# EAGLE design Bias_Lighting_Controller_Schematic (EAGLE 7.5.0)
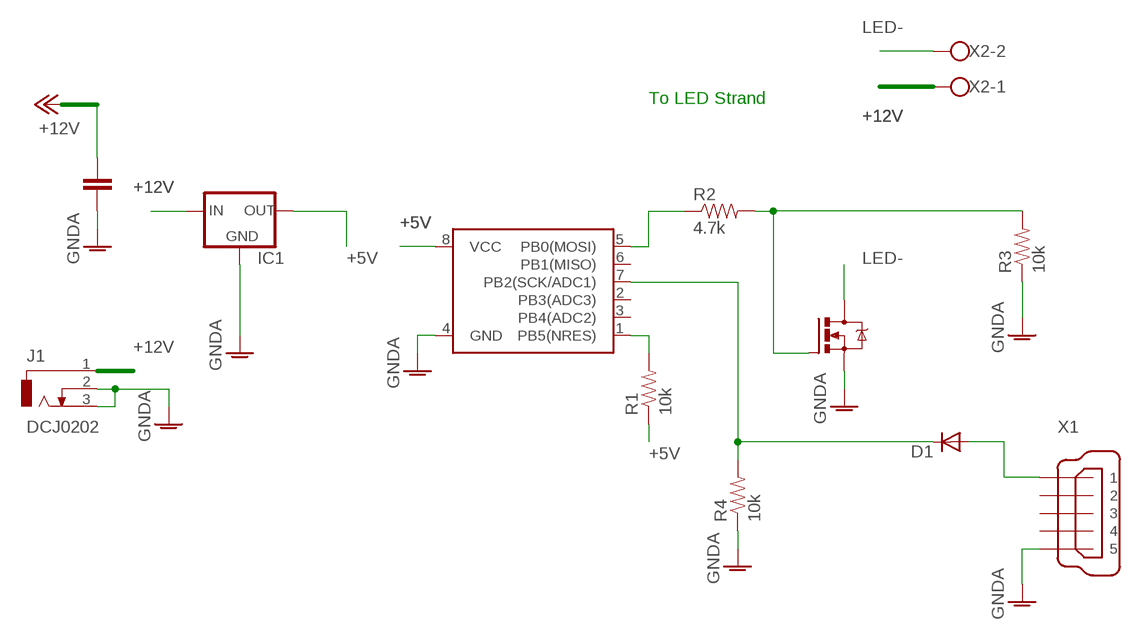
[diagram p0: schematic, sheet 1]

## Parts
C1  CAP1206  [1206]
D1  DIODESMA  [SMA-DIODE]
IC1  78LXX  [78LXX]
IRF740_MOSFET  IRF740  [TO220BV]
J1  DCJ0202  [DCJ0202]
R1  10k  RESISTOR1206  [1206]
R2  4.7k  RESISTOR1206  [1206]
R3  10k  RESISTOR1206  [1206]
R4  10k  RESISTOR1206  [1206]
U$1  ATTINY45DIP8  [DIP08]
X1  MINI-USB-UX60-MB-5ST  [UX60-MB-5ST]
X2  W237-102  [W237-102]

## Nets
+5V: IC1.OUT R1.1 U$1.8(VCC)
+12V: C1.2 IC1.IN J1.1 X2.1
GNDA: C1.1 IC1.GND IRF740_MOSFET.S J1.2 J1.3 R3.1 R4.1 U$1.4(GND) X1.5
LED-: IRF740_MOSFET.D X2.2
N$1: R1.2 U$1.1(PB5(NRES))
N$2: R2.1 U$1.5(PB0(MOSI))
N$3: D1.A X1.1
N$4: IRF740_MOSFET.G R2.2 R3.2
N$5: D1.C R4.2 U$1.7(PB2(SCK/ADC1))
Unconnected: U$1.2(PB3(ADC3)) U$1.3(PB4(ADC2)) U$1.6(PB1(MISO)) X1.2 X1.3 X1.4

## Notes on the sheet
- To LED Strand

## Library data of the parts
C1 = SparkFun-Passives:CAP: Capacitor Standard 0603 ceramic capacitor, and 0.1" leaded capacitor.
D1 = SparkFun-DiscreteSemi:DIODE: Diode These are standard reverse protection diodes and small signal diodes. SMA package can handle up to about 1A. SOD-323 can handle about 200mA. What the SOD-323 package when ordering, there are some mfgs out there that are 5-pin packages.
IC1 = v-reg:78LXX: VOLTAGE REGULATOR
IRF740_MOSFET = transistor-power:IRF740: N-CHANNEL MOS FET
J1 = con-jack:DCJ0202: DC POWER JACK Source: DCJ0202.pdf; OC_FARNELL: unknown; OC_NEWARK: unknown
R1-R4 = SparkFun-Resistors:RESISTOR: Resistor Basic schematic elements and footprints for 0603, 1206, and PTH resistors.
U$1 = SparkFun-DigitalIC:ATTINY45: Atmel 8-pin 2/4/8kB flash uC
X1 = con-hirose:MINI-USB-: MINI USB Connector Source: http://www.hirose.co.jp/cataloge_hp/e24000019.pdf; OC_FARNELL: unknown; OC_NEWARK: unknown
X2 = con-wago-500:W237-102: WAGO SCREW CLAMP; MPN: 237-102; OC_FARNELL: unknown; OC_NEWARK: 70K9898

## Board
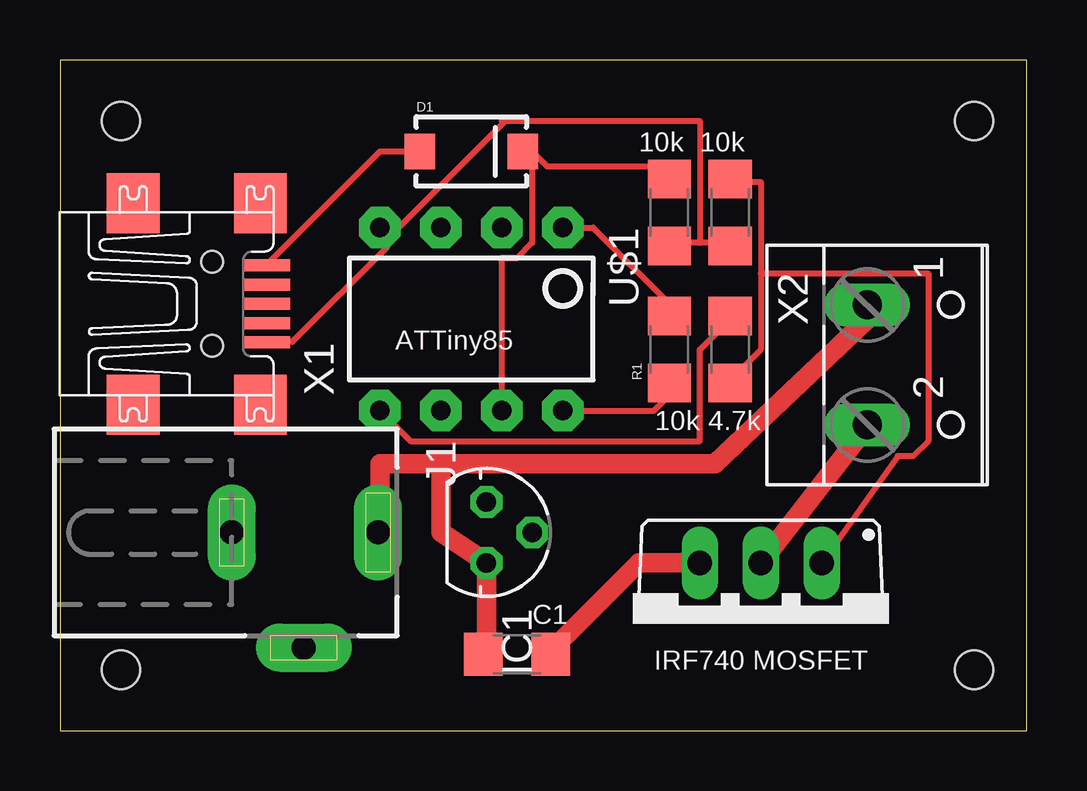
[diagram p1: board, top side]
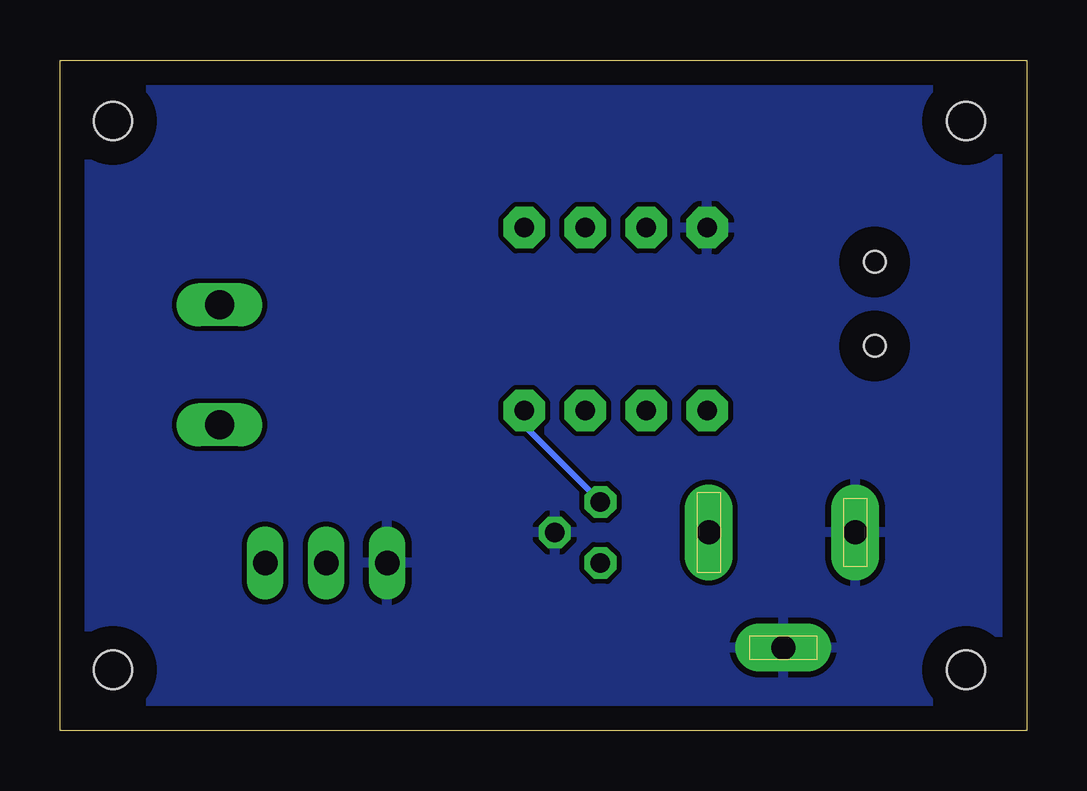
[diagram p2: board, bottom side, seen from below]

Size 40.31 x 27.94 mm. Coordinates in mm from the lower left corner, seen from the top.
Outline: 0,27.93 40.31,27.93 40.31,0 0,0 0,27.94
Copper layers (1*16): Top 0.035mm / dielectric 1.5mm / Bottom 0.035mm
Design rules "default *": minimum track width 10mil, minimum drill 24mil, track to track 8mil, track to pad 8mil, pad to pad 8mil, via to via 8mil, smd to smd 8mil, copper to edge 40mil, drill to drill 8mil, minimum pad ring 10mil, minimum via ring 8mil, stop-mask expansion 3mil, vias tented up to drill 0mil, thermal gap 10mil
Holes 1.6 mm at 2.54,25.4 2.54,2.54 38.1,2.54 38.1,25.4

### Footprints (pad centres in the part's own frame; a part is rotated, then mirrored left to right if it is on the bottom)
1206 = smd 1.6 x 1.8: 1 -1.4,0; 2 1.4,0
SMA-DIODE = smd 1.27 x 1.47: A -2.15,0; C 2.15,0
78LXX = drill 0.813 octagon: GND 0,1.905; IN 1.27,0; OUT -1.27,0
TO220BV = drill 1.016 long: D 0,-2.54; G -2.54,-2.54; S 2.54,-2.54
DCJ0202 = drill 1 pad 2 long: 1 0,3.1; 2 4.8,0; 3 0,-3
DIP08 = drill 0.813 pad 1.727 octagon: 1 -3.81,-3.81; 2 -1.27,-3.81; 3 1.27,-3.81; 4 3.81,-3.81; 5 3.81,3.81; 6 1.27,3.81; 7 -1.27,3.81; 8 -3.81,3.81
UX60-MB-5ST = smd 2 x 0.5: 1 2.25,1.6; 2 2.25,0.8; 3 2.25,0; 4 2.25,-0.8; 5 2.25,-1.6 | smd 2.2 x 2.5: M1 -3.3,-4.2; M2 -3.3,4.2; M3 2,4.2; M4 2,-4.2 | hole 0.9: 0,-1.75; 0,1.75
W237-102 = drill 1.194 long: 1 -2.5,-1.27; 2 2.5,-1.27

### Placement (x,y rotation side)
C1  19.05,3.18 180 top
D1  17.14,24.13 0 top
IC1  17.78,8.26 270 top
IRF740_MOSFET  29.21,4.45 180 top
J1  10.16,8.26 270 top
R1  25.4,15.88 90 top
R2  27.94,15.88 270 top
R3  27.94,21.59 90 top
R4  25.4,21.59 90 top
U$1  17.14,17.14 180 top
X1  6.35,17.78 0 top
X2  34.92,15.24 270 top

### Tracks (layer width: path | path; a pad name or v marks a point on that pad's centre or on a via)
+5V
  Top 0.254: U$1.8 24.77,13.34 25.4,13.97 R1.1
  Bottom 0.254: IC1.OUT 20.95,12.7 U$1.8
+12V
  Top 0.254: 17.78,3.81 17.14,3.18 C1.2 | 33.66,17.14 X2.1 | 13.34,8.26 J1.1
  Top 0.813: 17.78,3.81 IC1.IN 15.88,8.26 15.88,11.11 | 33.66,17.14 27.3,11.11 15.88,11.11 | 15.88,11.11 13.34,11.11 13.34,8.26
GNDA
  Top 0.254: 26.67,20.32 27.94,20.32 R3.1 | 26.67,20.32 25.4,20.32 R4.1 | 26.67,20.32 26.67,25.4 18.57,25.4 | 18.41,25.4 18.57,25.4 | U$1.4 13.97,20.96 | 13.72,20.9 U$1.4 | 13.65,20.8 13.65,20.16 9.68,16.19 8.73,16.19 X1.5 | 13.65,20.8 13.97,20.8 18.57,25.4 | 13.65,20.8 U$1.4 | C1.1 19.89,3.3 20.12,3.3 20.32,3.18
  Top 0.813: 20.32,3.18 24.13,6.99 IRF740_MOSFET.S
  pour Bottom: 0,27.94 39.37,27.94 39.37,0 0,0
LED-
  Top 0.254: 33.66,12.7 X2.2
  Top 0.813: 33.66,12.7 IRF740_MOSFET.D
N$1
  Top 0.254: U$1.1 22.23,20.96 25.4,17.78 R1.2
N$2
  Top 0.254: U$1.5 14.61,12.07 26.67,12.07 26.67,15.88 27.94,17.14 R2.1
N$3
  Top 0.254: 14.86,24.11 D1.A 13.34,24.13 8.73,19.53 X1.1
N$4
  Top 0.254: 29.21,19.05 29.21,22.86 27.94,22.86 R3.2 | 29.21,19.05 29.21,15.88 27.94,14.61 R2.2 | IRF740_MOSFET.G 34.92,11.43 35.56,11.43 36.2,12.07 36.2,19.05 29.21,19.05
N$5
  Top 0.254: 19.68,24.13 20.32,23.5 25.4,23.5 R4.2 | U$1.7 18.41,19.68 19.05,19.68 19.68,20.32 19.68,24.13 | 19.68,24.13 D1.C

### Text on the board
tNames: 10k | 10k | ATTiny85 | 10k | 4.7k | C1 | IRF740 MOSFET